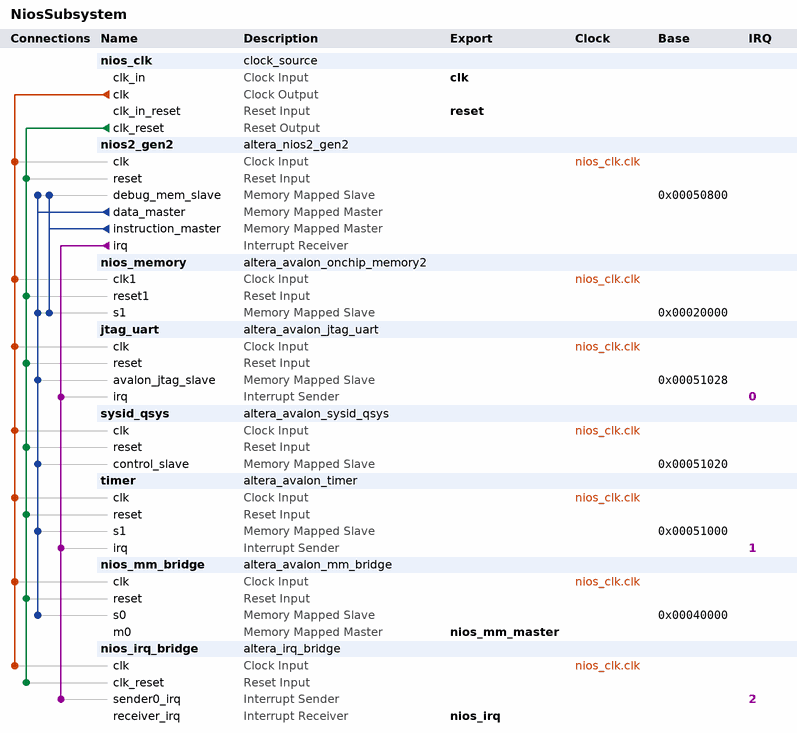
[diagram p0: system contents]
# Platform Designer (Qsys) system NiosSubsystem, MAX 10 10M50DAF484C6GES
# Parameters at their usual value, and those the tool derives, are not listed.
package require -exact qsys 15.0
create_system NiosSubsystem
set_project_property DEVICE_FAMILY {MAX 10}
set_project_property DEVICE 10M50DAF484C6GES

add_instance nios_clk clock_source 15.0
set_instance_parameter_value nios_clk clockFrequency 50000000

add_instance nios2_gen2 altera_nios2_gen2 15.0
set_instance_parameter_value nios2_gen2 dcache_size 2048
set_instance_parameter_value nios2_gen2 exceptionSlave nios_memory.s1
set_instance_parameter_value nios2_gen2 icache_size 4096
set_instance_parameter_value nios2_gen2 impl Tiny
set_instance_parameter_value nios2_gen2 resetSlave nios_memory.s1

add_instance nios_memory altera_avalon_onchip_memory2 15.0
set_instance_parameter_value nios_memory dataWidth 32
set_instance_parameter_value nios_memory dualPort false
set_instance_parameter_value nios_memory initMemContent false
set_instance_parameter_value nios_memory initializationFileName onchip_mem.hex
set_instance_parameter_value nios_memory memorySize 32768

add_instance jtag_uart altera_avalon_jtag_uart 15.0
set_instance_parameter_value jtag_uart simInteractiveOptions NO_INTERACTIVE_WINDOWS

add_instance sysid_qsys altera_avalon_sysid_qsys 15.0
set_instance_parameter_value sysid_qsys id 0

add_instance timer altera_avalon_timer 15.0
set_instance_parameter_value timer period 1
set_instance_parameter_value timer periodUnits MSEC

add_instance nios_mm_bridge altera_avalon_mm_bridge 15.0
set_instance_parameter_value nios_mm_bridge ADDRESS_UNITS SYMBOLS
set_instance_parameter_value nios_mm_bridge ADDRESS_WIDTH 16
set_instance_parameter_value nios_mm_bridge DATA_WIDTH 32
set_instance_parameter_value nios_mm_bridge MAX_PENDING_RESPONSES 4
set_instance_parameter_value nios_mm_bridge USE_AUTO_ADDRESS_WIDTH 0

add_instance nios_irq_bridge altera_irq_bridge 15.0
set_instance_parameter_value nios_irq_bridge IRQ_WIDTH 1

# connections
add_connection nios_clk.clk jtag_uart.clk clock
add_connection nios_clk.clk nios2_gen2.clk clock
add_connection nios_clk.clk nios_irq_bridge.clk clock
add_connection nios_clk.clk nios_memory.clk1 clock
add_connection nios_clk.clk nios_mm_bridge.clk clock
add_connection nios_clk.clk sysid_qsys.clk clock
add_connection nios_clk.clk timer.clk clock
add_connection nios_clk.clk_reset jtag_uart.reset reset
add_connection nios_clk.clk_reset nios2_gen2.reset reset
add_connection nios_clk.clk_reset nios_irq_bridge.clk_reset reset
add_connection nios_clk.clk_reset nios_memory.reset1 reset
add_connection nios_clk.clk_reset nios_mm_bridge.reset reset
add_connection nios_clk.clk_reset sysid_qsys.reset reset
add_connection nios_clk.clk_reset timer.reset reset
add_connection nios2_gen2.data_master jtag_uart.avalon_jtag_slave avalon
set_connection_parameter_value nios2_gen2.data_master/jtag_uart.avalon_jtag_slave baseAddress 0x00051028
add_connection nios2_gen2.data_master nios2_gen2.debug_mem_slave avalon
set_connection_parameter_value nios2_gen2.data_master/nios2_gen2.debug_mem_slave baseAddress 0x00050800
add_connection nios2_gen2.data_master nios_memory.s1 avalon
set_connection_parameter_value nios2_gen2.data_master/nios_memory.s1 baseAddress 0x00020000
add_connection nios2_gen2.data_master nios_mm_bridge.s0 avalon
set_connection_parameter_value nios2_gen2.data_master/nios_mm_bridge.s0 baseAddress 0x00040000
add_connection nios2_gen2.data_master sysid_qsys.control_slave avalon
set_connection_parameter_value nios2_gen2.data_master/sysid_qsys.control_slave baseAddress 0x00051020
add_connection nios2_gen2.data_master timer.s1 avalon
set_connection_parameter_value nios2_gen2.data_master/timer.s1 baseAddress 0x00051000
add_connection nios2_gen2.instruction_master nios2_gen2.debug_mem_slave avalon
set_connection_parameter_value nios2_gen2.instruction_master/nios2_gen2.debug_mem_slave baseAddress 0x00050800
add_connection nios2_gen2.instruction_master nios_memory.s1 avalon
set_connection_parameter_value nios2_gen2.instruction_master/nios_memory.s1 baseAddress 0x00020000
add_connection nios2_gen2.irq jtag_uart.irq interrupt
set_connection_parameter_value nios2_gen2.irq/jtag_uart.irq irqNumber 0
add_connection nios2_gen2.irq nios_irq_bridge.sender0_irq interrupt
set_connection_parameter_value nios2_gen2.irq/nios_irq_bridge.sender0_irq irqNumber 2
add_connection nios2_gen2.irq timer.irq interrupt
set_connection_parameter_value nios2_gen2.irq/timer.irq irqNumber 1

# exported interfaces
add_interface clk clock sink
set_interface_property clk EXPORT_OF nios_clk.clk_in
add_interface nios_irq interrupt receiver
set_interface_property nios_irq EXPORT_OF nios_irq_bridge.receiver_irq
add_interface nios_mm_master avalon master
set_interface_property nios_mm_master EXPORT_OF nios_mm_bridge.m0
add_interface reset reset sink
set_interface_property reset EXPORT_OF nios_clk.clk_in_reset

set_interconnect_requirement {$system} qsys_mm.clockCrossingAdapter HANDSHAKE
set_interconnect_requirement {$system} qsys_mm.enableEccProtection FALSE
set_interconnect_requirement {$system} qsys_mm.insertDefaultSlave FALSE
set_interconnect_requirement {$system} qsys_mm.maxAdditionalLatency 1

save_system NiosSubsystem.qsys
